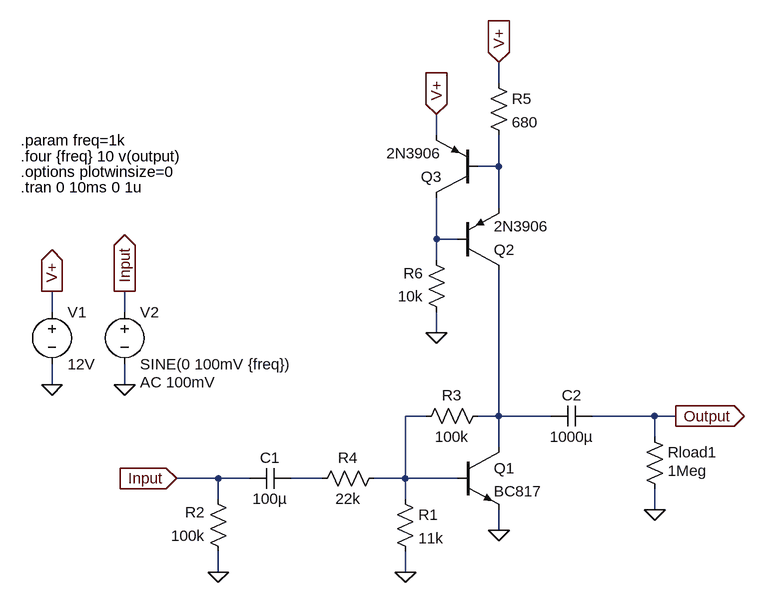
[diagram p0: schematic Common-Emitter with CCS Shunt Feedback.asc]
Common-Emitter with CCS Shunt Feedback.asc, the LTspice schematic file:
Version 4
SHEET 1 1284 680
WIRE 352 -416 352 -448
WIRE 256 -336 256 -368
WIRE 352 -288 352 -336
WIRE 352 -288 320 -288
WIRE 352 -224 352 -288
WIRE 256 -176 256 -240
WIRE 288 -176 256 -176
WIRE 256 -144 256 -176
WIRE -336 -64 -336 -96
WIRE -224 -64 -224 -96
WIRE 256 -32 256 -64
WIRE -336 48 -336 16
WIRE -224 48 -224 16
WIRE 240 96 208 96
WIRE 352 96 352 -128
WIRE 352 96 320 96
WIRE 432 96 352 96
WIRE 592 96 496 96
WIRE 624 96 592 96
WIRE 592 128 592 96
WIRE 352 144 352 96
WIRE -80 192 -144 192
WIRE -32 192 -80 192
WIRE 80 192 32 192
WIRE 208 192 208 96
WIRE 208 192 160 192
WIRE 288 192 208 192
WIRE -80 224 -80 192
WIRE 208 224 208 192
WIRE 592 240 592 208
WIRE 352 272 352 240
WIRE -80 336 -80 304
WIRE 208 336 208 304
FLAG 208 336 0
FLAG -144 192 Input
IOPIN -144 192 In
FLAG -336 48 0
FLAG -224 48 0
FLAG -336 -96 V+
IOPIN -336 -96 Out
FLAG -224 -96 Input
IOPIN -224 -96 Out
FLAG -80 336 0
FLAG 592 240 0
FLAG 624 96 Output
IOPIN 624 96 Out
FLAG 352 272 0
FLAG 352 -448 V+
IOPIN 352 -448 In
FLAG 256 -32 0
FLAG 256 -368 V+
IOPIN 256 -368 In
SYMBOL npn 288 144 R0
SYMATTR InstName Q1
SYMATTR Value BC817
SYMBOL res 192 208 R0
SYMATTR InstName R1
SYMATTR Value 11k
SYMBOL cap 32 176 R90
WINDOW 0 0 32 VBottom 2
WINDOW 3 32 32 VTop 2
SYMATTR InstName C1
SYMATTR Value 100µ
SYMBOL voltage -336 -80 R0
WINDOW 123 0 0 Left 0
WINDOW 39 0 0 Left 0
SYMATTR InstName V1
SYMATTR Value 12V
SYMBOL voltage -224 -80 R0
WINDOW 123 24 124 Left 2
WINDOW 39 0 0 Left 0
SYMATTR Value2 AC 100mV
SYMATTR InstName V2
SYMATTR Value SINE(0 100mV {freq})
SYMBOL res -64 320 R180
WINDOW 0 36 76 Left 2
WINDOW 3 36 40 Left 2
SYMATTR InstName R2
SYMATTR Value 100k
SYMBOL res 576 112 R0
WINDOW 3 36 68 Left 2
SYMATTR Value 1Meg
SYMATTR InstName Rload1
SYMBOL cap 496 80 R90
WINDOW 0 0 32 VBottom 2
WINDOW 3 32 32 VTop 2
SYMATTR InstName C2
SYMATTR Value 1000µ
SYMBOL res 336 80 R90
WINDOW 0 0 56 VBottom 2
WINDOW 3 32 56 VTop 2
SYMATTR InstName R3
SYMATTR Value 100k
SYMBOL res 176 176 R90
WINDOW 0 0 56 VBottom 2
WINDOW 3 32 56 VTop 2
SYMATTR InstName R4
SYMATTR Value 22k
SYMBOL res 336 -432 R0
SYMATTR InstName R5
SYMATTR Value 680
SYMBOL pnp 288 -128 M180
SYMATTR InstName Q2
SYMATTR Value 2N3906
SYMBOL res 272 -48 R180
WINDOW 0 36 76 Left 2
WINDOW 3 36 40 Left 2
SYMATTR InstName R6
SYMATTR Value 10k
SYMBOL pnp 320 -240 R180
SYMATTR InstName Q3
SYMATTR Value 2N3906
TEXT -384 -256 Left 2 !.tran 0 10ms 0 1u
TEXT -384 -280 Left 2 !.options plotwinsize=0
TEXT -384 -304 Left 2 !.four {freq} 10 v(output)
TEXT -384 -328 Left 2 !.param freq=1k

The netlist it stands for:
* Common-Emitter with CCS Shunt Feedback.asc
Q1 N004 N003 0 0 BC817
R1 N003 0 11k
C1 N005 Input 100µ
V1 V+ 0 12V
V2 Input 0 SINE(0 100mV {freq}) AC 100mV
R2 0 Input 100k
Rload1 Output 0 1Meg
C2 Output N004 1000µ
R3 N004 N003 100k
R4 N003 N005 22k
R5 V+ N001 680
Q2 N004 N002 N001 0 2N3906
R6 0 N002 10k
Q3 N002 N001 V+ 0 2N3906
.model NPN NPN
.model PNP PNP
.lib standard.bjt
.tran 0 10ms 0 1u
.options plotwinsize=0
.four {freq} 10 v(output)
.param freq=1k
.backanno
.end